# EAGLE design eeprom_burner (EAGLE 7.0.0)
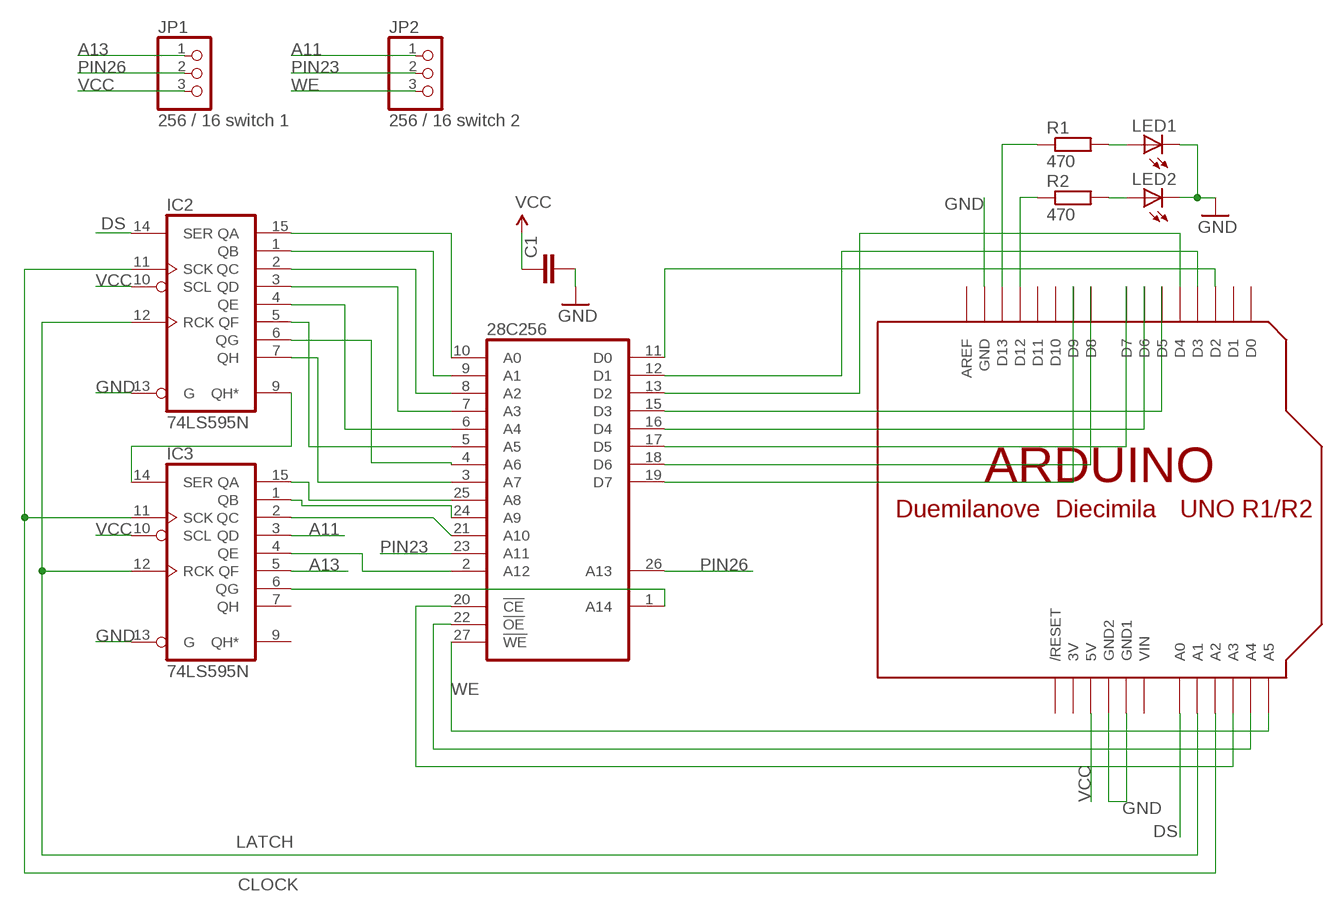
[diagram p0: schematic, sheet 1]

## Parts
28C256  2864  [DIL28]
C1  CAPPTH  [CAP-PTH-SMALL]
IC2  74LS595N  [DIL16]
IC3  74LS595N  [DIL16]
JP1  256 / 16 switch 1  PINHD-1X3  [1X03]
JP2  256 / 16 switch 2  PINHD-1X3  [1X03]
LED1  LED3MM  [LED3MM]
LED2  LED3MM  [LED3MM]
R1  470  R-EU_0204/7  [0204/7]
R2  470  R-EU_0204/7  [0204/7]
U$1  ARDUINO-NODIM  [ARDUINO-NODIM]

## Nets
A11: IC3.3(QD) JP2.1
A13: IC3.5(QF) JP1.1
CLOCK: IC2.11(SCK) IC3.11(SCK) U$1.A2
DS: IC2.14(SER) U$1.A0
GND: C1.2 IC2.13(G) IC3.13(G) LED1.K(C) LED2.K(C) U$1.GND U$1.GND1 U$1.GND2
LATCH: IC2.12(RCK) IC3.12(RCK) U$1.A1
N$1: R2.1 U$1.D12
N$2: 28C256.22(!OE) U$1.A4
N$3: 28C256.20(!CE) U$1.A3
N$4: 28C256.11(D0) U$1.D2
N$5: 28C256.12(D1) U$1.D3
N$6: 28C256.13(D2) U$1.D4
N$7: 28C256.15(D3) U$1.D5
N$8: 28C256.16(D4) U$1.D6
N$9: 28C256.17(D5) U$1.D7
N$10: 28C256.18(D6) U$1.D8
N$11: 28C256.19(D7) U$1.D9
N$12: 28C256.10(A0) IC2.15(QA)
N$13: 28C256.9(A1) IC2.1(QB)
N$14: 28C256.8(A2) IC2.2(QC)
N$15: 28C256.7(A3) IC2.3(QD)
N$16: 28C256.6(A4) IC2.4(QE)
N$17: 28C256.5(A5) IC2.5(QF)
N$18: 28C256.4(A6) IC2.6(QG)
N$19: 28C256.3(A7) IC2.7(QH)
N$20: IC2.9(QH*) IC3.14(SER)
N$21: 28C256.25(A8) IC3.15(QA)
N$22: 28C256.24(A9) IC3.1(QB)
N$23: 28C256.21(A10) IC3.2(QC)
N$24: R1.1 U$1.D13
N$25: 28C256.2(A12) IC3.4(QE)
N$26: LED1.A R1.2
N$27: 28C256.1(A14) IC3.6(QG)
N$28: LED2.A R2.2
PIN23: 28C256.23(A11) JP2.2
PIN26: 28C256.26(A13) JP1.2
VCC: C1.1 IC2.10(SCL) IC3.10(SCL) JP1.3 U$1.5V
WE: 28C256.27(!WE) JP2.3 U$1.A5
Unconnected: IC3.7(QH) IC3.9(QH*) U$1.AREF U$1.D0 U$1.D1 U$1.D10 U$1.D11 U$1.RESET(/RESET)

## Power pins joined to a net without a drawn wire
3V: U$1.3V
GND: 28C256.14(GND) IC2.8(GND) IC3.8(GND)
VCC: 28C256.28(VCC) IC2.16(VCC) IC3.16(VCC)
VIN: U$1.VIN

## Library data of the parts
28C256 = modded_memory:2864: MEMORY
C1 = SparkFun:CAP: Capacitor Standard 0603 ceramic capacitor, and 0.1" leaded capacitor.
IC2 IC3 = 74xx-us:74*595: 8-bit SHIFT REGISTER, output latch
JP1 JP2 = pinhead:PINHD-1X3: PIN HEADER
LED1 LED2 = led:LED: LED OSRAM: - CHIPLED LG R971, LG N971, LY N971, LG Q971, LY Q971, LO R971, LY R971 LH N974, LH R974 LS Q976, LO Q976, LY Q976 LO Q996 - Hyper CHIPLED LW Q18S LB Q993, LB Q99A, LB R99A - SideLED LS A670, LO A670, LY A670, LG A670, LP A670 LB A673, LV A673, LT A673, LW A673 LH A674 LY A675 LS A676, LA A676, LO A676, LY A676, LW A676 LS A679, LY A679, LG A679 - Hyper Micro SIDELED® LS Y876, LA Y876, LO Y876, LY Y876 LT Y87S - SmartLED LW L88C, LW L88S LB L89C, LB L89S, LG L890 LS L89K, LO L89K, LY L89K LS L896, LA L896, LO L896, LY L896 - TOPLED LS T670, LO T670, LY T670, LG T670, LP T670 LSG T670, LSP T670, LSY T670, LOP T670, LYG T670 LG T671, LOG T671, LSG T671 LB T673, LV T673, LT T673, LW T673 LH T674 LS T676, LA T676, LO T676, LY T676, LB T676, LH T676, LSB T676, LW T676 LB T67C, LV T67C, LT T67C, LS T67K, LO T67K, LY T67K, LW E67C LS E67B, LA E67B, LO E67B, LY E67B, LB E67C, LV E67C, LT E67C LW T67C LS T679, LY T679, LG T679 LS T770, LO T770, LY T770, LG T770, LP T770 LB T773, LV T773, LT T773, LW T773 LH T774 LS E675, LA E675, LY E675, LS T675 LS T776, LA T776, LO T776, LY T776, LB T776 LHGB T686 LT T68C, LB T68C - Hyper Mini TOPLED® LB M676 - Mini TOPLED Santana® LG M470 LS M47K, LO M47K, LY M47K Source: http://www.osram.convergy.de LUXEON: - LUMILED® LXK2-PW12-R00, LXK2-PW12-S00, LXK2-PW14-U00, LXK2-PW14-V00 LXK2-PM12-R00, LXK2-PM12-S00, LXK2-PM14-U00 LXK2-PE12-Q00, LXK2-PE12-R00, LXK2-PE12-S00, LXK2-PE14-T00, LXK2-PE14-U00 LXK2-PB12-K00, LXK2-PB12-L00, LXK2-PB12-M00, LXK2-PB14-N00, LXK2-PB14-P00, LXK2-PB14-Q00 LXK2-PR12-L00, LXK2-PR12-M00, LXK2-PR14-Q00, LXK2-PR14-R00 LXK2-PD12-Q00, LXK2-PD12-R00, LXK2-PD12-S00 LXK2-PH12-R00, LXK2-PH12-S00 LXK2-PL12-P00, LXK2-PL12-Q00, LXK2-PL12-R00 Source: www.luxeon.com KINGBRIGHT: KA-3528ASYC Source: www.kingbright.com
R1 R2 = resistor:R-EU_: RESISTOR, European symbol
U$1 = adafruit:ARDUINO: Arduino Diecimila/Duemilanove Make a shield with ease, this package has all the named pins as well as the two mounting drill holes and an outline of the USB and DC power connector. The outline is on the DIMENSION layer, so if your board house uses it they will cut the outline to match. http://www.ladyada.net/library/pcb/eaglelibrary.html

## Board
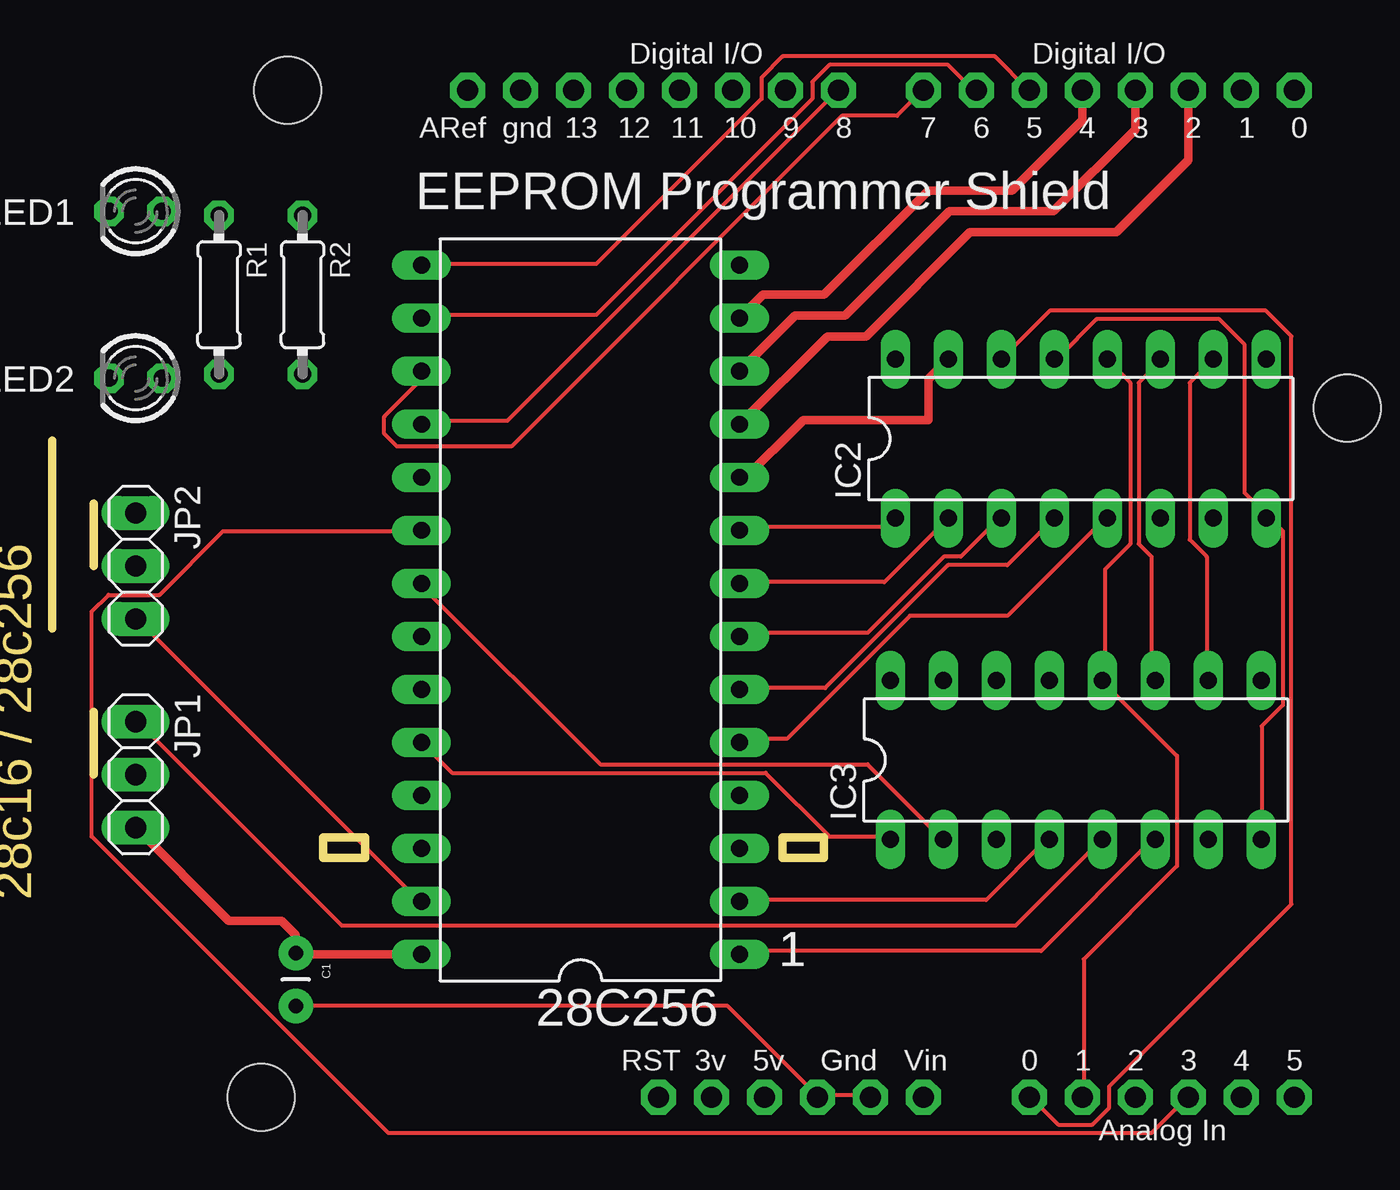
[diagram p1: board, top side]
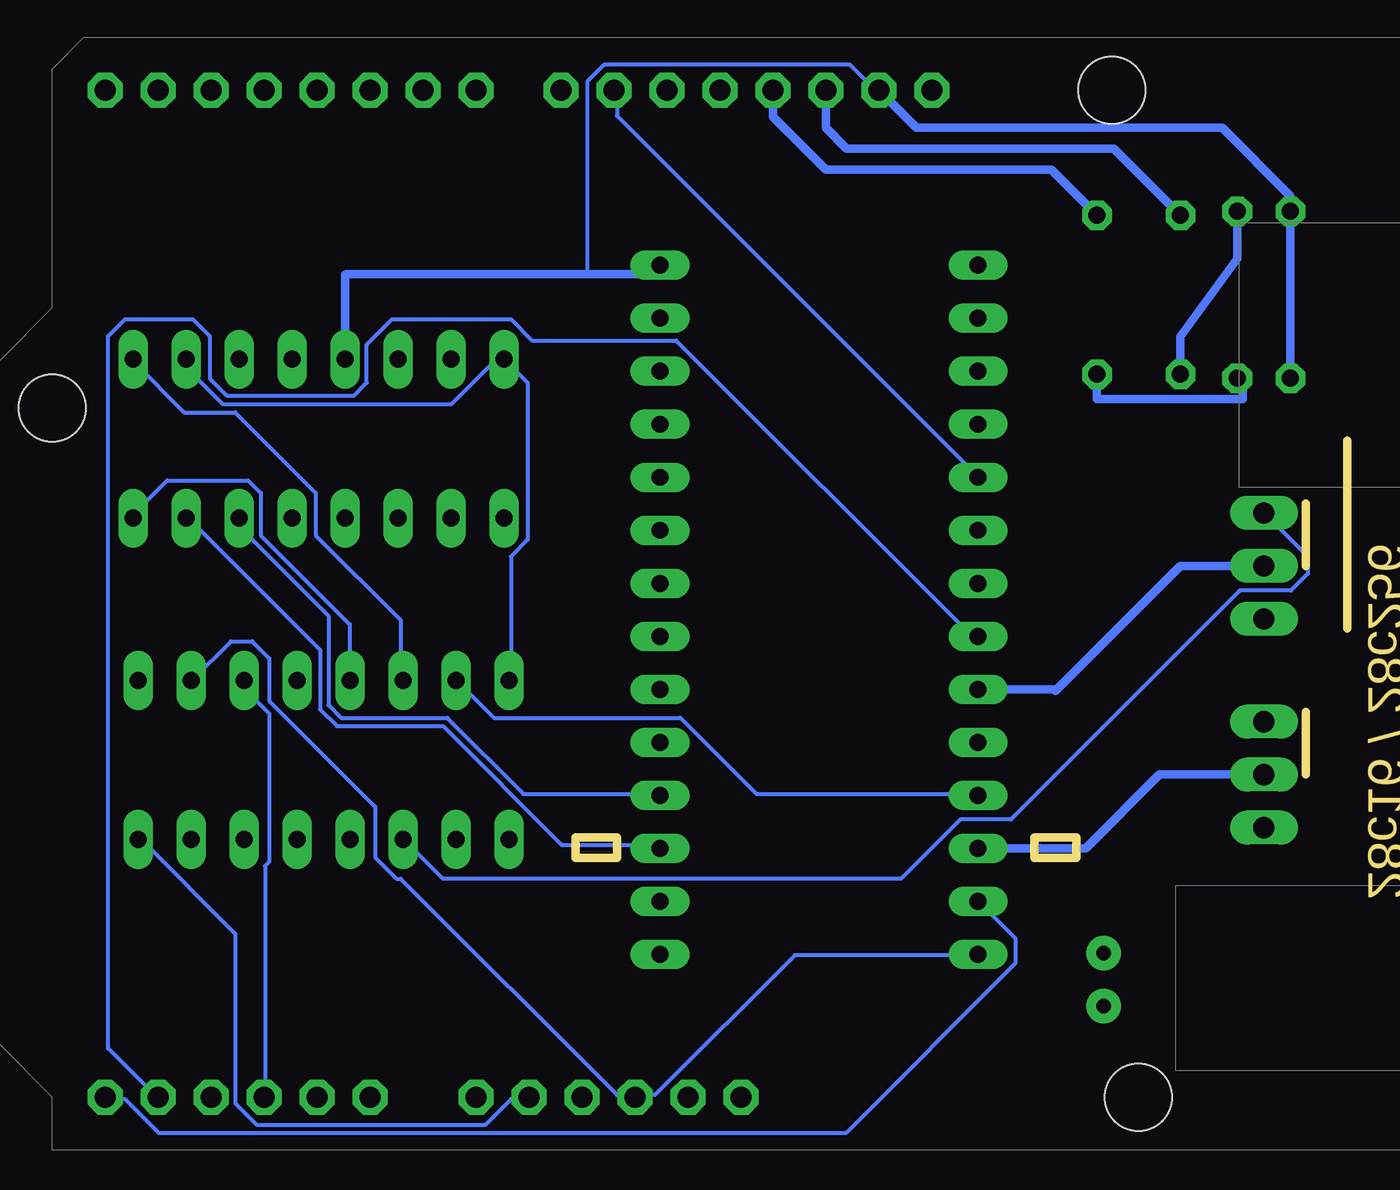
[diagram p2: board, bottom side, seen from below]

Size 37 x 20 mm. Coordinates in mm from the lower left corner, seen from the top.
Outline: 0,11 0,20
Outline: 2,4 2,7
Outline: 2,14 2,17
Copper layers (1*16): Top 0.035mm / dielectric 1.5mm / Bottom 0.035mm
Design rules "SparkFun": minimum track width 8mil, minimum drill 20mil, track to track 8mil, track to pad 8mil, pad to pad 8mil, via to via 8mil, smd to smd 8mil, copper to edge 10mil, drill to drill 8mil, minimum pad ring 12mil, minimum via ring 10mil, stop-mask expansion 4mil, vias tented up to drill 25mil, thermal gap 10mil

### Footprints (pad centres in the part's own frame; a part is rotated, then mirrored left to right if it is on the bottom)
DIL28 = drill 0.813 long: 1 -16.51,-7.62; 2 -13.97,-7.62; 3 -11.43,-7.62; 4 -8.89,-7.62; 5 -6.35,-7.62; 6 -3.81,-7.62; 7 -1.27,-7.62; 8 1.27,-7.62; 9 3.81,-7.62; 10 6.35,-7.62; 11 8.89,-7.62; 12 11.43,-7.62; 13 13.97,-7.62; 14 16.51,-7.62; 15 16.51,7.62; 16 13.97,7.62; 17 11.43,7.62; 18 8.89,7.62; 19 6.35,7.62; 20 3.81,7.62; 21 1.27,7.62; 22 -1.27,7.62; 23 -3.81,7.62; 24 -6.35,7.62; 25 -8.89,7.62; 26 -11.43,7.62; 27 -13.97,7.62; 28 -16.51,7.62
CAP-PTH-SMALL = drill 0.7 pad 1.651: 1 0,0; 2 2.54,0
DIL16 = drill 0.813 long: 1 -8.89,-3.81; 2 -6.35,-3.81; 3 -3.81,-3.81; 4 -1.27,-3.81; 5 1.27,-3.81; 6 3.81,-3.81; 7 6.35,-3.81; 8 8.89,-3.81; 9 8.89,3.81; 10 6.35,3.81; 11 3.81,3.81; 12 1.27,3.81; 13 -1.27,3.81; 14 -3.81,3.81; 15 -6.35,3.81; 16 -8.89,3.81
1X03 = drill 1.016 long: 1 -2.54,0; 2 0,0; 3 2.54,0
LED3MM = drill 0.813 octagon: A -1.27,0; K 1.27,0
0204/7 = drill 0.813 octagon: 1 -3.81,0; 2 3.81,0
ARDUINO-NODIM = drill 1 pad 1.676 octagon: 3V 35.56,2.54; 5V 38.1,2.54; A0 50.8,2.54; A1 53.34,2.54; A2 55.88,2.54; A3 58.42,2.54; A4 60.96,2.54; A5 63.5,2.54; AREF 23.876,50.8; D0 63.5,50.8; D1 60.96,50.8; D2 58.42,50.8; D3 55.88,50.8; D4 53.34,50.8; D5 50.8,50.8; D6 48.26,50.8; D7 45.72,50.8; D8 41.656,50.8; D9 39.116,50.8; D10 36.576,50.8; D11 34.036,50.8; D12 31.496,50.8; D13 28.956,50.8; GND 26.416,50.8; GND1 43.18,2.54; GND2 40.64,2.54; RESET 33.02,2.54; VIN 45.72,2.54 | hole 3.2: 15.24,50.8; 66.04,35.56; 13.97,2.54

### Placement (x,y rotation side)
28C256  25.32,11.9 90 top
C1  11.68,-4.55 270 top  (outside the outline)
IC2  49.3,20.1 0 top  (outside the outline)
IC3  49.07,4.7 0 top  (outside the outline)
JP1  4,4 270 top
JP2  4,14 270 top
LED1  4,31 180 top  (outside the outline)
LED2  4,23 180 top
R1  8,27 270 top  (outside the outline)
R2  12,27 270 top  (outside the outline)
U$1  -3.96,-14 0 top

### Tracks (layer width: path | path; a pad name or v marks a point on that pad's centre or on a via)
A11
  Bottom 0.203: IC3.3 45.17,0.83 43.35,-0.99 21.4,-0.99 18.55,1.85 16.12,1.85 5.14,12.82 2.71,12.82 1.89,13.64 1.89,14.45 3.92,16.48 JP2.1
A13
  Top 0.203: IC3.5 50.25,0.83 46.19,-3.23 13.88,-3.23 4.13,6.52 JP1.1
CLOCK
  Top 0.203: IC3.11 52.69,8.55 52.69,14.45 52.08,15.06 52.08,22.78 53.1,23.8 IC2.11
  Bottom 0.203: U$1.A2 51.88,-11.36 51.88,-0.39 51.68,-0.18 51.68,6.93 52.69,7.95 52.69,8.35 IC3.11
DS
  Top 0.203: IC2.14 45.58,24 47.82,26.23 58.18,26.23 59.4,25.01 59.4,-2.21 50.66,-10.95 50.66,-11.97 49.85,-12.78 48.22,-12.78 47,-11.56 U$1.A0
GND
  Top 0.203: C1.2 11.85,-7.09 32.37,-7.09 36.64,-11.36 U$1.GND2 36.84,-11.36 39.08,-11.36 U$1.GND1 | IC3.8 57.98,1.04 57.98,6.32 58.99,7.34 58.99,15.67 58.38,16.28 IC2.8 58.18,16.48 57.16,17.5 57.16,24.61 55.94,25.83 50.05,25.83 48.22,24 IC2.13
  Bottom 0.203: IC3.13 47.82,8.55 47.82,11.2 52.08,15.46 52.08,17.5 52.69,18.11 56.55,18.11 58.18,16.48 IC2.8 | 36.44,28 36.44,37.21 35.62,38.02 23.84,38.02 22.62,36.8 U$1.GND | U$1.GND1 39.28,-11.56 40.09,-11.56 41.31,-12.78 52.29,-12.78 53.3,-11.77 53.3,-3.64 57.77,0.83 IC3.8
  Bottom 0.406: LED2.K LED1.K 2.73,31.73 6,35 20.66,35 U$1.GND 22,37.26 | 28C256.14 33.35,28 36.44,28 48,28 48.03,27.97 IC2.13
LATCH
  Top 0.203: IC2.12 50.66,23.8 51.68,22.78 51.68,15.06 50.46,13.84 50.46,8.55 IC3.12 50.46,8.35 53.91,4.9 53.91,-0.39 49.44,-4.86 49.44,-11.36 U$1.A1
N$1
  Bottom 0.406: R2.1 14.19,33 25,33 27.54,35.53 U$1.D12
N$2
  Bottom 0.203: 28C256.22 17.74,10.79 18.15,10.79 32.17,24.81 39.08,24.81 40.09,25.83 45.78,25.83 47,24.61 47,22.78 47.61,22.17 53.71,22.17 54.52,22.98 54.52,25.01 55.33,25.83 58.59,25.83 59.4,25.01 59.4,-9.12 57.16,-11.36 U$1.A4
N$3
  Top 0.203: 28C256.20 17.54,15.67 8.19,15.67 5.14,12.62 2.71,12.62 1.89,11.81 1.89,1.04 16.12,-13.19 52.69,-13.19 54.32,-11.56 U$1.A3
N$4
  Top 0.406: 28C256.11 37.15,25 39,25 44,30 51,30 54.46,33.46 U$1.D2
N$5
  Top 0.406: 28C256.12 35.61,26 38,26 43,31 48,31 51.92,34.92 U$1.D3
N$6
  Top 0.406: 28C256.13 34.07,27 37,27 42,32 46,32 49.38,35.38 U$1.D4
N$7
  Top 0.203: 28C256.15 17.74,28.47 26.07,28.47 34,36.39 34,37.41 35.01,38.43 45.17,38.43 46.8,36.8 U$1.D5
N$8
  Top 0.203: 28C256.16 17.74,26.03 26.07,26.03 36.44,36.39 36.44,37.21 37.25,38.02 42.94,38.02 44.16,36.8 U$1.D6
N$9
  Top 0.203: 28C256.17 17.54,23.19 17.54,22.78 15.91,21.15 15.91,20.34 16.52,19.73 22.01,19.73 37.86,35.58 40.5,35.58 41.72,36.8 U$1.D7
N$10
  Top 0.203: 28C256.18 17.74,20.95 21.81,20.95 37.66,36.8 U$1.D8
N$11
  Bottom 0.203: 28C256.19 17.74,18.31 35.01,35.58 35.01,36.8 U$1.D9
N$12
  Top 0.203: 28C256.10 32.98,18.11 33.04,18.04
  Top 0.406: IC2.15 42,22.96 42,21 36,21 33.04,18.04 33,18
N$13
  Top 0.203: 28C256.9 32.98,15.87 39.89,15.87 40.3,16.28 IC2.1
N$14
  Top 0.203: 28C256.8 32.98,13.23 39.89,13.23 42.94,16.28 IC2.2
N$15
  Top 0.203: 28C256.7 32.98,10.79 39.08,10.79 42.74,14.45 43.55,14.45 45.38,16.28 IC2.3
N$16
  Top 0.203: 28C256.6 32.98,8.15 37.05,8.15 42.94,14.04 45.78,14.04 48.02,16.28 IC2.4
N$17
  Top 0.203: 28C256.5 32.98,5.71 35.22,5.71 41.11,11.6 45.78,11.6 50.46,16.28 IC2.5
N$18
  Bottom 0.203: 28C256.4 32.98,3.07 39.48,3.07 43.14,6.73 48.22,6.73 48.83,7.34 48.83,11.6 53.1,15.87 53.1,16.28 IC2.6
N$19
  Bottom 0.203: 28C256.3 32.98,0.63 37.66,0.63 43.35,6.32 48.43,6.32 49.24,7.13 49.24,9.98 55.54,16.28 IC2.7
N$20
  Bottom 0.203: IC3.14 45.38,8.55 45.38,11.4 49.44,15.46 49.44,17.5 53.3,21.36 55.74,21.36 58.18,23.8 IC2.9
N$21
  Bottom 0.203: 28C256.25 17.74,3.07 28.31,3.07 31.97,6.73 40.91,6.73 42.53,8.35 IC3.15
N$22
  Top 0.203: IC3.1 40.09,1.04 37.25,1.04 34.2,4.09 19.16,4.09 17.74,5.51 28C256.24
N$23
  Top 0.203: IC3.2 42.53,1.04 39.08,4.49 26.28,4.49 17.74,13.03 28C256.21
N$24
  Bottom 0.406: R1.1 11.19,34 24,34 25,35 25,35.01 U$1.D13
N$25
  Top 0.203: 28C256.2 32.98,-2.01 44.77,-2.01 47.61,0.83 IC3.4
N$26
  Bottom 0.406: R1.2 8,25 5.27,28.73 LED1.A
N$27
  Top 0.203: 28C256.1 32.98,-4.45 47.41,-4.45 52.69,0.83 IC3.6
N$28
  Bottom 0.406: LED2.A 5,23 5,22 12,22 R2.2
PIN23
  Bottom 0.406: JP2.2 8,14 14,8 14.09,8.09 28C256.23
PIN26
  Bottom 0.406: JP1.2 9,4 12.53,0.47 28C256.26
VCC
  Top 0.203: IC3.10 55.33,8.55 55.33,14.45 54.52,15.26 54.52,22.78 55.54,23.8 IC2.10
  Top 0.406: JP1.3 8.46,-3 11,-3 11.68,-3.68 C1.1 11.74,-4.61 28C256.28
  Bottom 0.203: 28C256.28 17.74,-4.65 26.48,-4.65 33.19,-11.36 34,-11.36 U$1.5V 34.2,-11.36 35.01,-11.36 45.38,-0.99 45.58,-0.99 46.6,0.02 46.6,2.46 51.68,7.54 51.68,9.57 52.49,10.38 53.51,10.38 55.33,8.55 IC3.10 | IC3.16 40.09,8.55 40.09,14.45 39.28,15.26 39.28,22.78 40.3,23.8 IC2.16 40.5,23.8 40.91,23.8 42.94,21.76 53.91,21.76 55.54,23.39 55.54,23.8 IC2.10
WE
  Top 0.203: 28C256.27 17.54,-2.01 4.13,11.4 JP2.3
  Bottom 0.203: U$1.A5 59.4,-11.56 58.59,-11.56 56.96,-13.19 24.04,-13.19 15.91,-5.06 15.91,-3.84 17.54,-2.21 28C256.27

### Text on the board
Dimension: 28c16 / 28c256
tNames: EEPROM Programmer Shield | 1